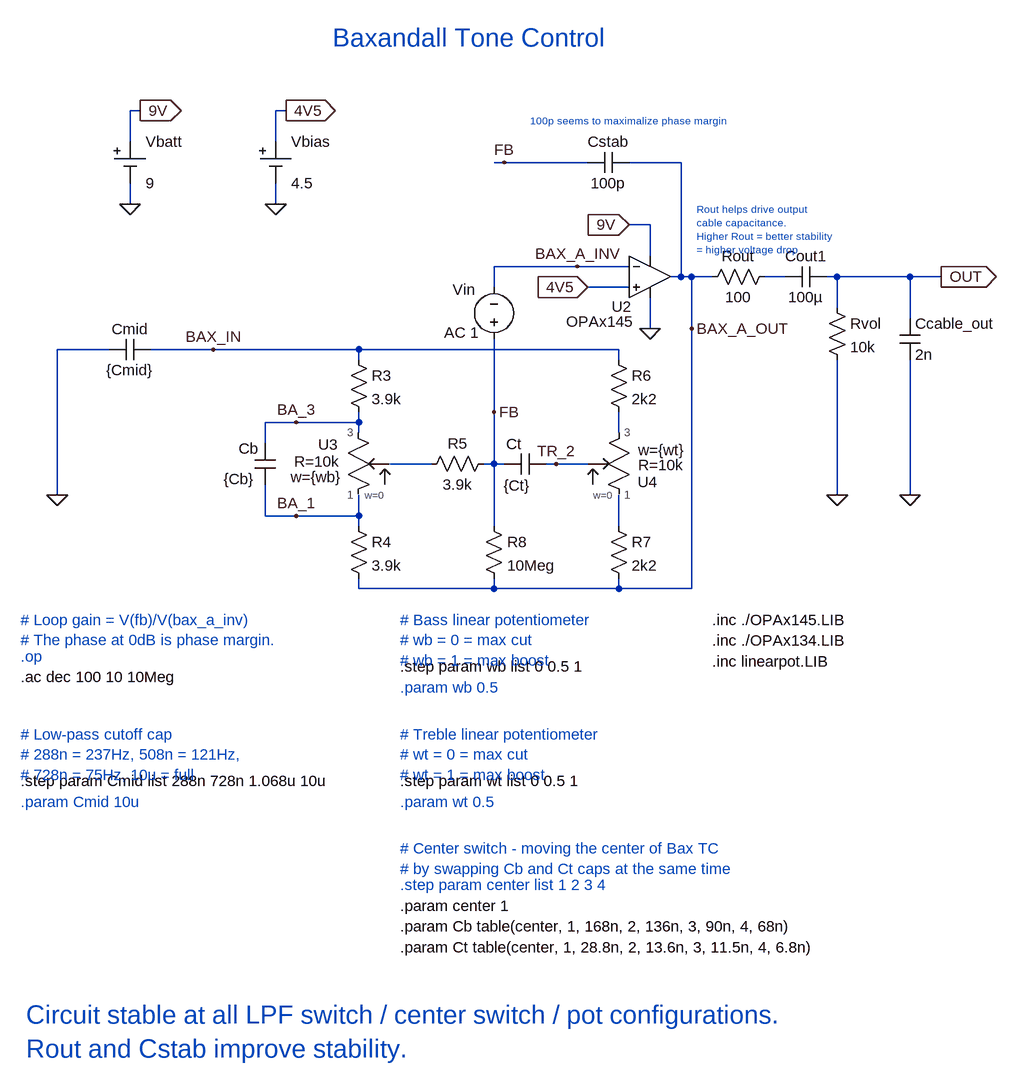
[diagram p0: schematic stability - baxandall only.asc]
stability - baxandall only.asc, the LTspice schematic file:
Version 4
SHEET 1 2076 1388
WIRE 752 -64 736 -64
WIRE 976 -64 960 -64
WIRE 736 -16 736 -64
WIRE 960 -16 960 -64
WIRE 1312 16 1296 16
WIRE 1440 16 1312 16
WIRE 1584 16 1504 16
WIRE 736 80 736 48
WIRE 960 80 960 48
WIRE 1536 112 1504 112
WIRE 1536 160 1536 112
WIRE 1424 176 1296 176
WIRE 1504 176 1424 176
WIRE 1584 192 1584 16
WIRE 1584 192 1568 192
WIRE 1600 192 1584 192
WIRE 1632 192 1600 192
WIRE 1744 192 1712 192
WIRE 1824 192 1808 192
WIRE 1936 192 1824 192
WIRE 1984 192 1936 192
WIRE 1296 208 1296 176
WIRE 1504 208 1440 208
WIRE 1824 240 1824 192
WIRE 1936 256 1936 192
WIRE 1536 272 1536 224
WIRE 1600 272 1600 192
WIRE 704 304 624 304
WIRE 864 304 768 304
WIRE 1088 304 864 304
WIRE 1488 304 1088 304
WIRE 1088 320 1088 304
WIRE 1488 320 1488 304
WIRE 1296 400 1296 288
WIRE 992 416 944 416
WIRE 1088 416 1088 400
WIRE 1088 416 992 416
WIRE 1088 432 1088 416
WIRE 1488 432 1488 400
WIRE 944 448 944 416
WIRE 1200 480 1136 480
WIRE 1296 480 1296 400
WIRE 1296 480 1280 480
WIRE 1312 480 1296 480
WIRE 1392 480 1376 480
WIRE 1440 480 1392 480
WIRE 624 528 624 304
WIRE 1824 528 1824 320
WIRE 1936 528 1936 320
WIRE 944 560 944 512
WIRE 992 560 944 560
WIRE 1088 560 1088 528
WIRE 1088 560 992 560
WIRE 1088 576 1088 560
WIRE 1296 576 1296 480
WIRE 1488 576 1488 528
WIRE 1088 672 1088 656
WIRE 1296 672 1296 656
WIRE 1296 672 1088 672
WIRE 1488 672 1488 656
WIRE 1488 672 1296 672
WIRE 1600 672 1600 272
WIRE 1600 672 1488 672
FLAG 1984 192 OUT
IOPIN 1984 192 Out
FLAG 736 80 0
FLAG 976 -64 4V5
IOPIN 976 -64 Out
FLAG 752 -64 9V
IOPIN 752 -64 Out
FLAG 1824 528 0
FLAG 1536 272 0
FLAG 1504 112 9V
IOPIN 1504 112 In
FLAG 1440 208 4V5
IOPIN 1440 208 In
FLAG 864 304 BAX_IN
FLAG 992 416 BA_3
FLAG 992 560 BA_1
FLAG 1392 480 TR_2
FLAG 1424 176 BAX_A_INV
FLAG 1600 272 BAX_A_OUT
FLAG 1936 528 0
FLAG 624 528 0
FLAG 960 80 0
FLAG 1296 400 FB
FLAG 1312 16 FB
SYMBOL Cap 768 288 R90
WINDOW 0 0 32 VBottom 2
WINDOW 3 32 32 VTop 2
SYMATTR InstName Cmid
SYMATTR Value {Cmid}
SYMBOL Res 1808 224 R0
SYMATTR InstName Rvol
SYMATTR Value 10k
SYMBOL Misc/cell 736 -16 R0
SYMATTR InstName Vbatt
SYMATTR Value 9
SYMBOL Res 1728 176 R90
WINDOW 0 0 56 VBottom 2
WINDOW 3 32 56 VTop 2
SYMATTR InstName Rout
SYMATTR Value 100
SYMBOL Res 1072 304 R0
SYMATTR InstName R3
SYMATTR Value 3.9k
SYMBOL Res 1072 560 R0
SYMATTR InstName R4
SYMATTR Value 3.9k
SYMBOL Cap 928 448 R0
WINDOW 0 -25 8 Left 2
WINDOW 3 -48 55 Left 2
SYMATTR InstName Cb
SYMATTR Value {Cb}
SYMBOL Res 1296 464 R90
WINDOW 0 0 56 VBottom 2
WINDOW 3 32 56 VTop 2
SYMATTR InstName R5
SYMATTR Value 3.9k
SYMBOL Cap 1376 464 R90
WINDOW 0 1 49 VBottom 2
WINDOW 3 34 45 VTop 2
SYMATTR InstName Ct
SYMATTR Value {Ct}
SYMBOL Res 1472 304 R0
SYMATTR InstName R6
SYMATTR Value 2k2
SYMBOL Res 1472 560 R0
SYMATTR InstName R7
SYMATTR Value 2k2
SYMBOL Opamps/opamp2 1536 128 R0
WINDOW 0 -59 110 Left 2
WINDOW 3 -129 133 Left 2
SYMATTR InstName U2
SYMATTR Value OPAx145
SYMBOL Res 1280 560 R0
SYMATTR InstName R8
SYMATTR Value 10Meg
SYMBOL Cap 1808 176 R90
WINDOW 0 0 32 VBottom 2
WINDOW 3 32 32 VTop 2
SYMATTR InstName Cout1
SYMATTR Value 100µ
SYMBOL linearpot 1088 432 R180
WINDOW 0 32 -18 Left 2
WINDOW 39 29 -44 Left 2
WINDOW 40 26 -68 Left 2
SYMATTR InstName U3
SYMATTR SpiceLine R=10k
SYMATTR SpiceLine2 w={wb}
SYMBOL linearpot 1488 432 M180
WINDOW 0 29 -76 Left 2
WINDOW 40 30 -27 Left 2
SYMATTR InstName U4
SYMATTR SpiceLine2 w={wt}
SYMATTR SpiceLine R=10k
SYMBOL Cap 1920 256 R0
SYMATTR InstName Ccable_out
SYMATTR Value 2n
SYMBOL Misc/cell 960 -16 R0
SYMATTR InstName Vbias
SYMATTR Value 4.5
SYMBOL voltage 1296 304 R180
WINDOW 0 46 77 Top 2
WINDOW 3 39 97 Invisible 2
WINDOW 123 50 42 Bottom 2
SYMATTR InstName Vin
SYMATTR Value ""
SYMATTR Value2 AC 1
SYMBOL Cap 1504 0 R90
WINDOW 0 0 32 VBottom 2
WINDOW 3 32 32 VTop 2
SYMATTR InstName Cstab
SYMATTR Value 100p
TEXT 1632 720 Left 2 !.inc ./OPAx145.LIB
TEXT 568 776 Left 2 ;.op
TEXT 1048 -176 Left 4 ;Baxandall Tone Control
TEXT 568 808 Left 2 !.ac dec 100 10 10Meg
TEXT 1632 752 Left 2 !.inc ./OPAx134.LIB
TEXT 1608 88 Left 1 ;Rout helps drive output\ncable capacitance.\nHigher Rout = better stability\n= higher voltage drop
TEXT 1632 784 Left 2 !.inc linearpot.LIB
TEXT 1152 792 Left 2 !.step param wb list 0 0.5 1
TEXT 1152 968 Left 2 !.step param wt list 0 0.5 1
TEXT 1152 824 Left 2 ;.param wb 0.5
TEXT 1152 1000 Left 2 ;.param wt 0.5
TEXT 1152 720 Left 2 ;# Bass linear potentiometer\n# wb = 0 = max cut\n# wb = 1 = max boost
TEXT 1152 896 Left 2 ;# Treble linear potentiometer\n# wt = 0 = max cut\n# wt = 1 = max boost
TEXT 568 968 Left 2 !.step param Cmid list 288n 728n 1.068u 10u
TEXT 568 1000 Left 2 ;.param Cmid 10u
TEXT 568 896 Left 2 ;# Low-pass cutoff cap\n# 288n = 237Hz, 508n = 121Hz, \n# 728n = 75Hz, 10u = full
TEXT 568 720 Left 2 ;# Loop gain = V(fb)/V(bax_a_inv)\n# The phase at 0dB is phase margin.
TEXT 1152 1128 Left 2 ;.step param center list 1 2 3 4
TEXT 1152 1192 Left 2 !.param Cb table(center, 1, 168n, 2, 136n, 3, 90n, 4, 68n)
TEXT 1152 1224 Left 2 !.param Ct table(center, 1, 28.8n, 2, 13.6n, 3, 11.5n, 4, 6.8n)
TEXT 1152 1072 Left 2 ;# Center switch - moving the center of Bax TC\n# by swapping Cb and Ct caps at the same time
TEXT 1152 1160 Left 2 !.param center 1
TEXT 1352 -48 Left 1 ;100p seems to maximalize phase margin
TEXT 576 1328 Left 4 ;Circuit stable at all LPF switch / center switch / pot configurations.\nRout and Cstab improve stability.

The netlist it stands for:
* stability - baxandall only.asc
Cmid BAX_IN 0 {Cmid}
Rvol OUT 0 10k
Vbatt 9V 0 9
Rout N001 BAX_A_OUT 100
R3 BAX_IN BA_3 3.9k
R4 BA_1 BAX_A_OUT 3.9k
Cb BA_3 BA_1 {Cb}
R5 FB N003 3.9k
Ct TR_2 FB {Ct}
R6 BAX_IN N002 2k2
R7 N004 BAX_A_OUT 2k2
XU2 4V5 BAX_A_INV 9V 0 BAX_A_OUT OPAx145  ; pins In+ In- V+ V- OUT
R8 FB BAX_A_OUT 10Meg
Cout1 OUT N001 100µ
XU3 BA_1 N003 BA_3 linearpot R=10k w={wb}  ; pins 1 2 3
XU4 N004 TR_2 N002 linearpot R=10k w={wt}  ; pins 1 2 3
Ccable_out OUT 0 2n
Vbias 4V5 0 4.5
Vin FB BAX_A_INV AC 1
Cstab BAX_A_OUT FB 100p
.inc ./OPAx145.LIB
* .op
* Baxandall Tone Control
.ac dec 100 10 10Meg
.inc ./OPAx134.LIB
* Rout helps drive output
* cable capacitance.
* Higher Rout = better stability
* = higher voltage drop
.inc linearpot.LIB
.step param wb list 0 0.5 1
.step param wt list 0 0.5 1
* .param wb 0.5
* .param wt 0.5
* # Bass linear potentiometer
* # wb = 0 = max cut
* # wb = 1 = max boost
* # Treble linear potentiometer
* # wt = 0 = max cut
* # wt = 1 = max boost
.step param Cmid list 288n 728n 1.068u 10u
* .param Cmid 10u
* # Low-pass cutoff cap
* # 288n = 237Hz, 508n = 121Hz,
* # 728n = 75Hz, 10u = full
* # Loop gain = V(fb)/V(bax_a_inv)
* # The phase at 0dB is phase margin.
* .step param center list 1 2 3 4
.param Cb table(center, 1, 168n, 2, 136n, 3, 90n, 4, 68n)
.param Ct table(center, 1, 28.8n, 2, 13.6n, 3, 11.5n, 4, 6.8n)
* # Center switch - moving the center of Bax TC
* # by swapping Cb and Ct caps at the same time
.param center 1
* 100p seems to maximalize phase margin
* Circuit stable at all LPF switch / center switch / pot configurations.
* Rout and Cstab improve stability.
.lib linearpot.lib
.backanno
.end